# EAGLE design test1 (EAGLE 5.11)
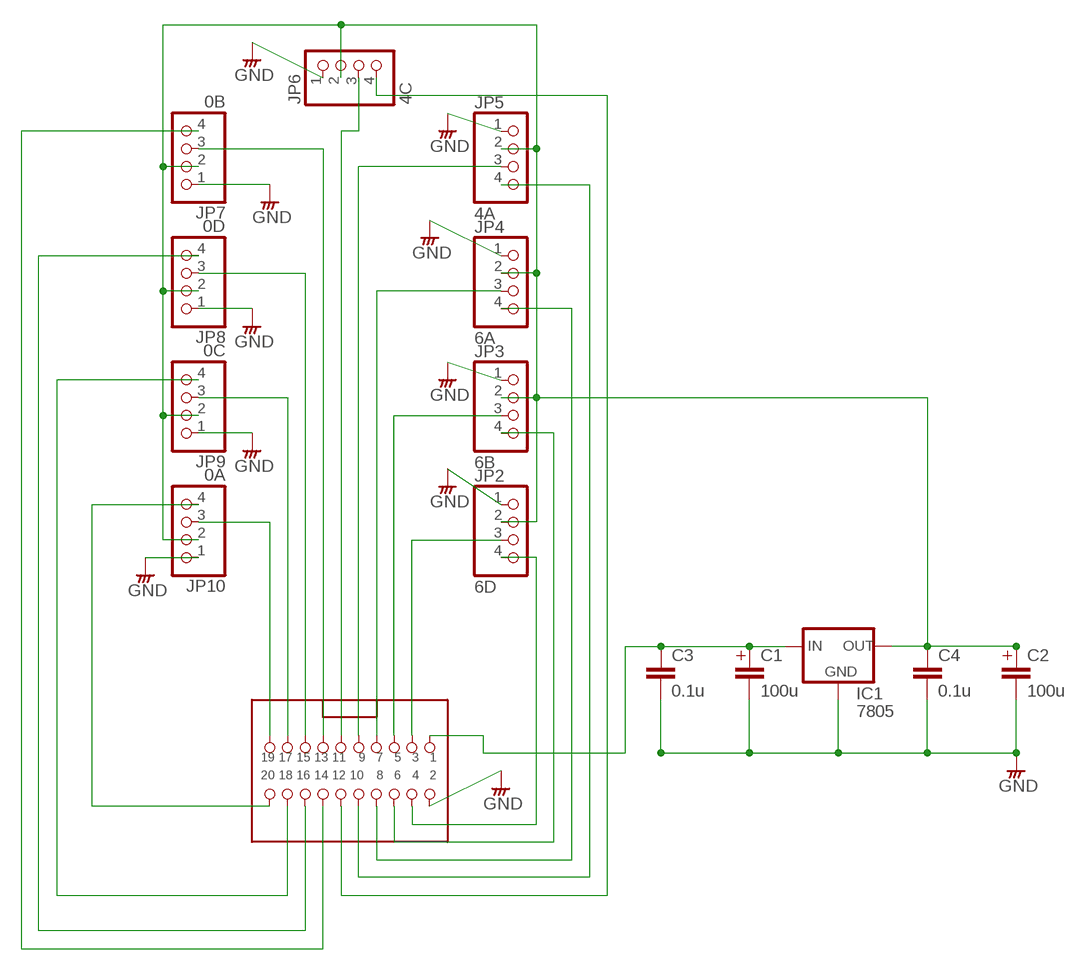
[diagram p0: schematic, sheet 1]

## Parts
C1  100u  CAPACITOR-2  [C_0.2]
C2  100u  CAPACITOR-2  [C_0.2]
C3  0.1u  MLCC-1  [MLCC_25]
C4  0.1u  MLCC-1  [MLCC_25]
IC1  7805  78  [78XX]
JP2  6D  PINHD-1X41*04_P  [1*04_P]
JP3  6B  PINHD-1X41*04_P  [1*04_P]
JP4  6A  PINHD-1X41*04_P  [1*04_P]
JP5  4A  PINHD-1X41*04_P  [1*04_P]
JP6  4C  PINHD-1X41*04_P  [1*04_P]
JP7  0B  PINHD-1X41*04_P  [1*04_P]
JP8  0D  PINHD-1X41*04_P  [1*04_P]
JP9  0C  PINHD-1X41*04_P  [1*04_P]
JP10  0A  PINHD-1X41*04_P  [1*04_P]
U$2  OMRON_XG4  [OMRON_XG4]

## Nets
GND: C1.P$2 C2.P$2 C3.2 C4.2 IC1.P$2(GND) JP2.1 JP3.1 JP4.1 JP5.1 JP6.1 JP7.1 JP8.1 JP9.1 JP10.1 U$2.P$2
N$2: JP2.3 U$2.P$3
N$3: JP5.4 U$2.P$10
N$5: JP3.3 U$2.P$5
N$6: JP4.3 U$2.P$7
N$7: JP5.3 U$2.P$9
N$8: JP6.3 U$2.P$11
N$9: JP7.3 U$2.P$13
N$10: JP8.3 U$2.P$15
N$11: JP9.3 U$2.P$17
N$12: JP10.3 U$2.P$19
N$13: JP2.4 U$2.P$4
N$14: JP3.4 U$2.P$6
N$15: JP4.4 U$2.P$8
N$16: JP6.4 U$2.P$12
N$17: JP7.4 U$2.P$14
N$18: JP8.4 U$2.P$16
N$19: JP9.4 U$2.P$18
N$20: JP10.4 U$2.P$20
N$21: C2.P$1 C4.1 IC1.P$3(OUT) JP2.2 JP3.2 JP4.2 JP5.2 JP6.2 JP7.2 JP8.2 JP9.2 JP10.2
N$22: C1.P$1 C3.1 IC1.P$1(IN) U$2.P$1

## Library data of the parts
C1 C2 = rcl__s:CAPACITOR
C3 C4 = rcl__s:MLCC: CAPACITOR, European symbol
IC1 = regulator_s:78*: VOLTAGE REGULATOR
JP2-JP10 = pinhead_s:PINHD-1X4: PIN HEADER
U$2 = pinhead_s:OMRON_XG4: OK

## Board
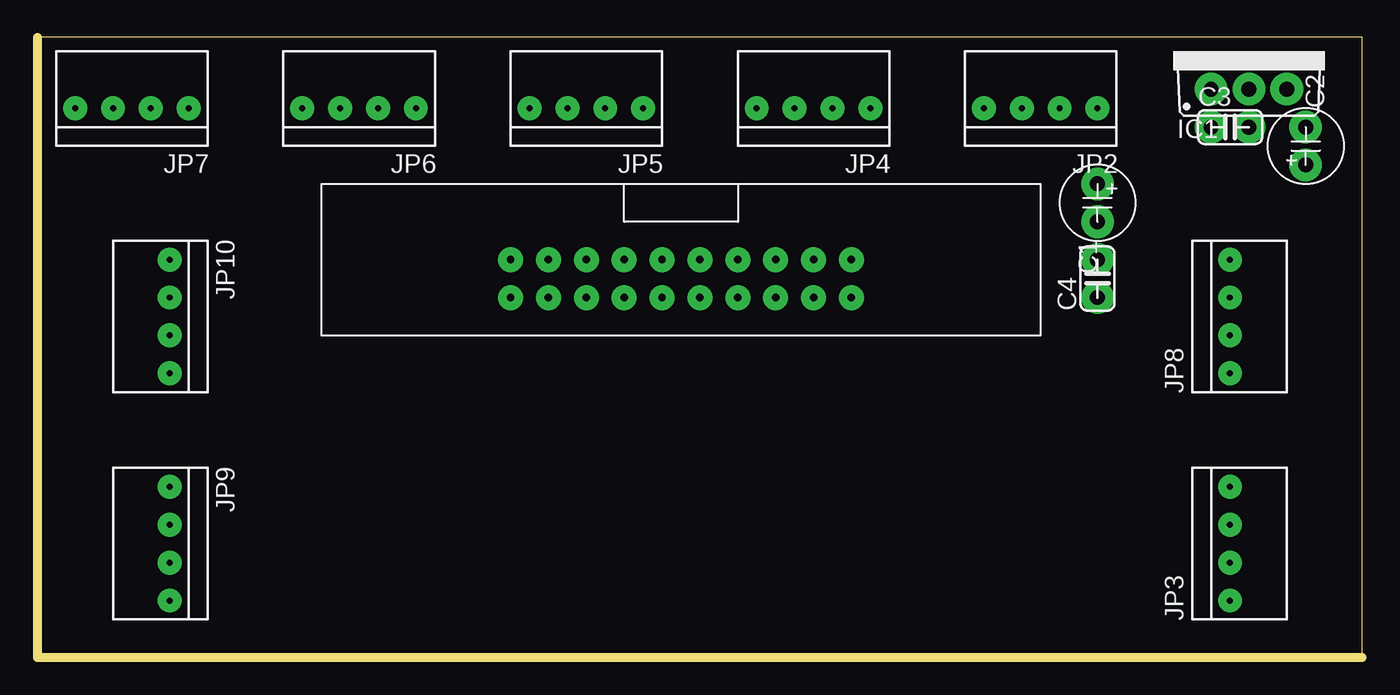
[diagram p1: board, top side]
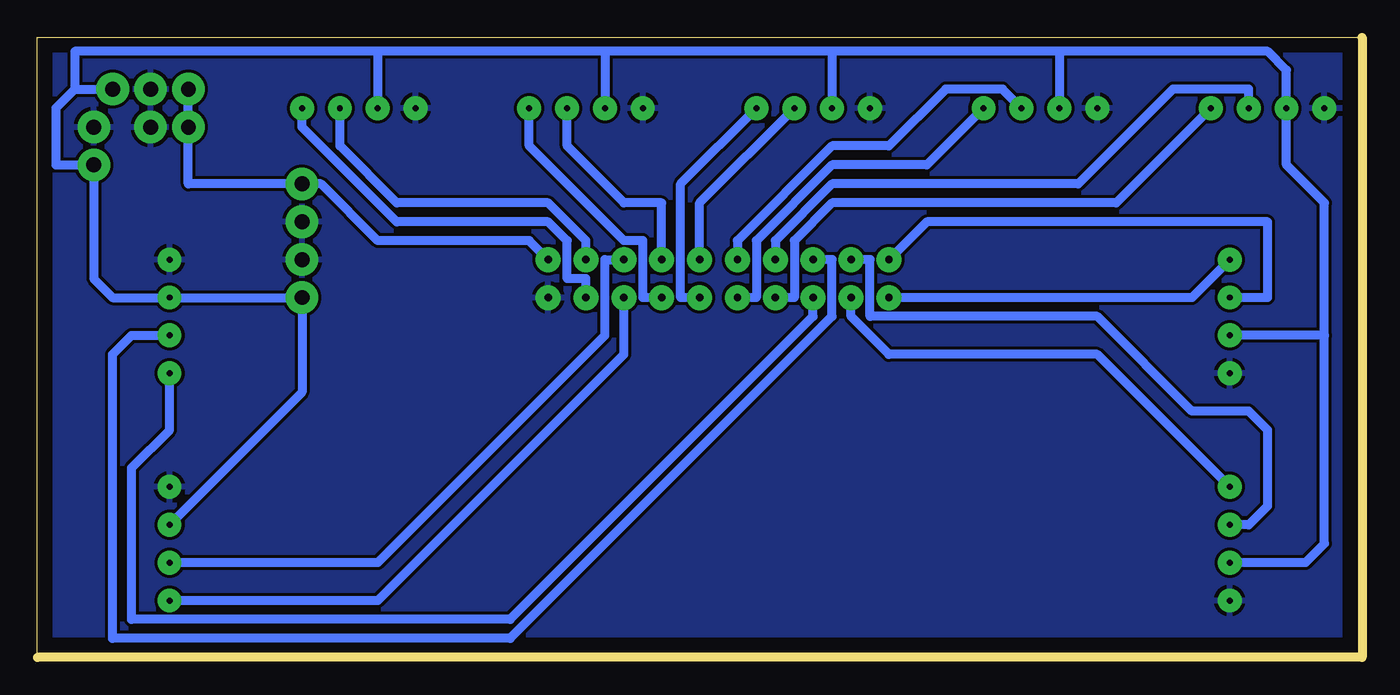
[diagram p2: board, bottom side, seen from below]

Size 88.88 x 41.58 mm. Coordinates in mm from the lower left corner, seen from the top.
Outline: 0,0 88.88,0 88.88,41.58 0,41.58 0,0
Copper layers (1*16): Top 0.035mm / dielectric 1.5mm / Bottom 0.035mm
Design rules "default": minimum track width 10mil, minimum drill 24mil, track to track 8mil, track to pad 8mil, pad to pad 8mil, via to via 8mil, smd to smd 8mil, copper to edge 40mil, drill to drill 8mil, minimum pad ring 10mil, minimum via ring 8mil, stop-mask expansion 4mil, vias tented up to drill 0mil, thermal gap 10mil

### Footprints (pad centres in the part's own frame; a part is rotated, then mirrored left to right if it is on the bottom)
C_0.2 = drill 1 pad 2.184 round: P$1 -1.27,0; P$2 1.27,0
MLCC_25 = drill 1 pad 2.184 round: 1 -1.27,0; 2 1.27,0
78XX = drill 1 pad 2.184 round: P$1 -2.54,0; P$2 0,0; P$3 2.54,0
1*04_P = drill 0.4 pad 1.6 round: 1 5.08,0; 2 2.54,0; 3 0,0; 4 -2.54,0
OMRON_XG4 = drill 0.5 pad 1.676 round: P$1 10.16,5.08; P$2 10.16,2.54; P$3 7.62,5.08; P$4 7.62,2.54; P$5 5.08,5.08; P$6 5.08,2.54; P$7 2.54,5.08; P$8 2.54,2.54; P$9 0,5.08; P$10 0,2.54; P$11 -2.54,5.08; P$12 -2.54,2.54; P$13 -5.08,5.08; P$14 -5.08,2.54; P$15 -7.62,5.08; P$16 -7.62,2.54; P$17 -10.16,5.08; P$18 -10.16,2.54; P$19 -12.7,5.08; P$20 -12.7,2.54

### Placement (x,y rotation side)
C1  71.12,30.48 270 top
C2  85.09,34.29 90 top
C3  80.01,35.56 0 top
C4  71.12,25.4 90 top
IC1  81.28,38.1 0 top
JP2  68.58,36.83 180 top
JP3  80.01,6.35 90 top
JP4  53.34,36.83 180 top
JP5  38.1,36.83 180 top
JP6  22.86,36.83 180 top
JP7  7.62,36.83 180 top
JP8  80.01,21.59 90 top
JP9  8.89,8.89 270 top
JP10  8.89,24.13 270 top
U$2  44.45,21.59 0 top

### Tracks (layer width: path | path; a pad name or v marks a point on that pad's centre or on a via)
GND
  pour Bottom: 0,41.91 88.9,41.91 88.9,0 0,0
N$2
  Bottom 0.61: JP2.3 68.58,34.29 64.77,30.48 54.61,30.48 52.07,27.94 U$2.P$3
N$3
  Bottom 0.61: JP5.4 45.72,31.75 45.72,24.13 U$2.P$10
N$5
  Bottom 0.61: JP3.3 66.04,6.35 50.8,21.59 50.8,26.67 U$2.P$5
N$6
  Bottom 0.61: JP4.3 53.34,34.29 49.53,30.48 46.99,30.48 U$2.P$7
N$7
  Bottom 0.61: JP5.3 44.45,30.48 U$2.P$9
N$8
  Bottom 0.61: JP6.3 24.13,38.1 27.94,38.1 31.75,34.29 35.56,34.29 41.91,27.94 U$2.P$11
N$9
  Bottom 0.61: JP7.3 7.62,38.1 12.7,38.1 19.05,31.75 35.56,31.75 39.37,27.94 U$2.P$13
N$10
  Bottom 0.61: JP8.3 82.55,21.59 83.82,20.32 83.82,1.27 57.15,1.27 35.56,22.86 35.56,26.67 U$2.P$15
N$11
  Bottom 0.61: JP9.3 7.62,8.89 6.35,10.16 6.35,15.24 7.62,16.51 11.43,16.51 17.78,22.86 33.02,22.86 33.02,26.67 U$2.P$17
N$12
  Bottom 0.61: JP10.3 6.35,24.13 6.35,29.21 29.21,29.21 U$2.P$19
N$13
  Bottom 0.61: JP2.4 71.12,35.56 64.77,29.21 54.61,29.21 53.34,27.94 53.34,25.4 52.07,25.4 U$2.P$4
N$14
  Bottom 0.61: JP3.4 66.04,3.81 49.53,20.32 U$2.P$6
N$15
  Bottom 0.61: JP4.4 55.88,34.29 49.53,27.94 48.26,27.94 48.26,24.13 U$2.P$8
N$16
  Bottom 0.61: JP6.4 29.21,33.02 35.56,33.02 40.64,27.94 40.64,24.13 U$2.P$12
N$17
  Bottom 0.61: JP7.4 16.51,30.48 35.56,30.48 38.1,27.94 38.1,24.13 U$2.P$14
N$18
  Bottom 0.61: JP8.4 80.01,15.24 82.55,12.7 82.55,2.54 57.15,2.54 36.83,22.86 U$2.P$16
N$19
  Bottom 0.61: JP9.4 17.78,20.32 31.75,20.32 34.29,22.86 U$2.P$18
N$20
  Bottom 0.61: JP10.4 11.43,24.13 U$2.P$20
N$21
  Bottom 0.61: JP3.2 71.12,17.78 C4.1 JP8.2 83.82,24.13 85.09,25.4 C2.P$1 87.63,33.02 87.63,36.83 86.36,38.1 | 86.36,38.1 IC1.P$3 | JP9.2 3.81,6.35 2.54,7.62 2.54,21.59 | 2.54,21.59 JP10.2 | 2.54,21.59 2.54,30.48 5.08,33.02 JP7.2 5.08,39.37 6.35,40.64 20.32,40.64 | 20.32,40.64 JP6.2 | 35.56,40.64 JP5.2 | 20.32,40.64 35.56,40.64 | 50.8,40.64 JP4.2 | 35.56,40.64 50.8,40.64 | 66.04,40.64 JP2.2 | 50.8,40.64 66.04,40.64 | 86.36,38.1 86.36,40.64 66.04,40.64
N$22
  Bottom 0.61: IC1.P$1 C3.1 78.74,31.75 C1.P$1 69.85,31.75 66.04,27.94 55.88,27.94 U$2.P$1